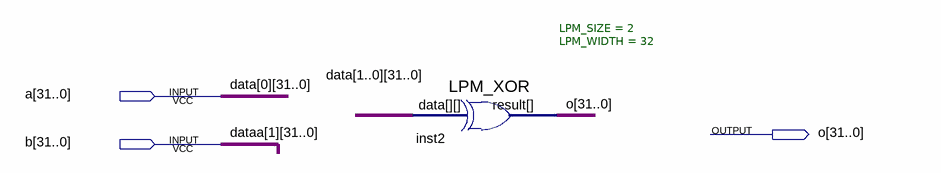
[diagram p0: schematic sheet]
// Quartus schematic XOR32.bdf as structural Verilog: 1 symbols, 3 pins
module XOR32 (
  input  [31:0] a,
  input  [31:0] b,
  output [31:0] o
);

  wire [31:0] data_1;

  LPM_XOR #(.LPM_SIZE(2), .LPM_WIDTH(32)) inst2 (.data({data_1, a}), .result(o));

  // Other names for the same wires on the sheet: data_0[31:0] = a; dataa_1[31:0] = b
endmodule
